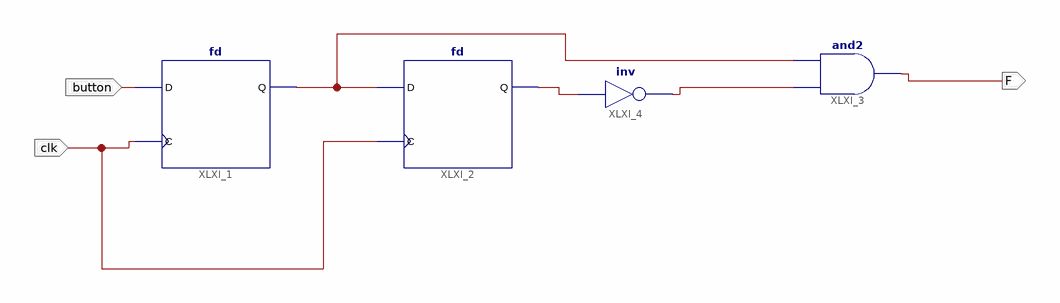
[diagram p0: schematic sheet 1]
// Xilinx ISE schematic Pulser.sch (spartan3e) as structural Verilog: 4 symbols, 3 ports
module Pulser (
  input  clk,
  input  button,
  output F
);

  wire XLXN_1, XLXN_5, XLXN_6;

  fd XLXI_1 (.C(clk), .D(button), .Q(XLXN_1));
  fd XLXI_2 (.C(clk), .D(XLXN_1), .Q(XLXN_5));
  and XLXI_3 (F, XLXN_6, XLXN_1);
  not XLXI_4 (XLXN_6, XLXN_5);

  // Notes on the sheet:
  //   clk on signal clk = P89
endmodule
